# Altium schematic sheet Support.SchDoc
size A4
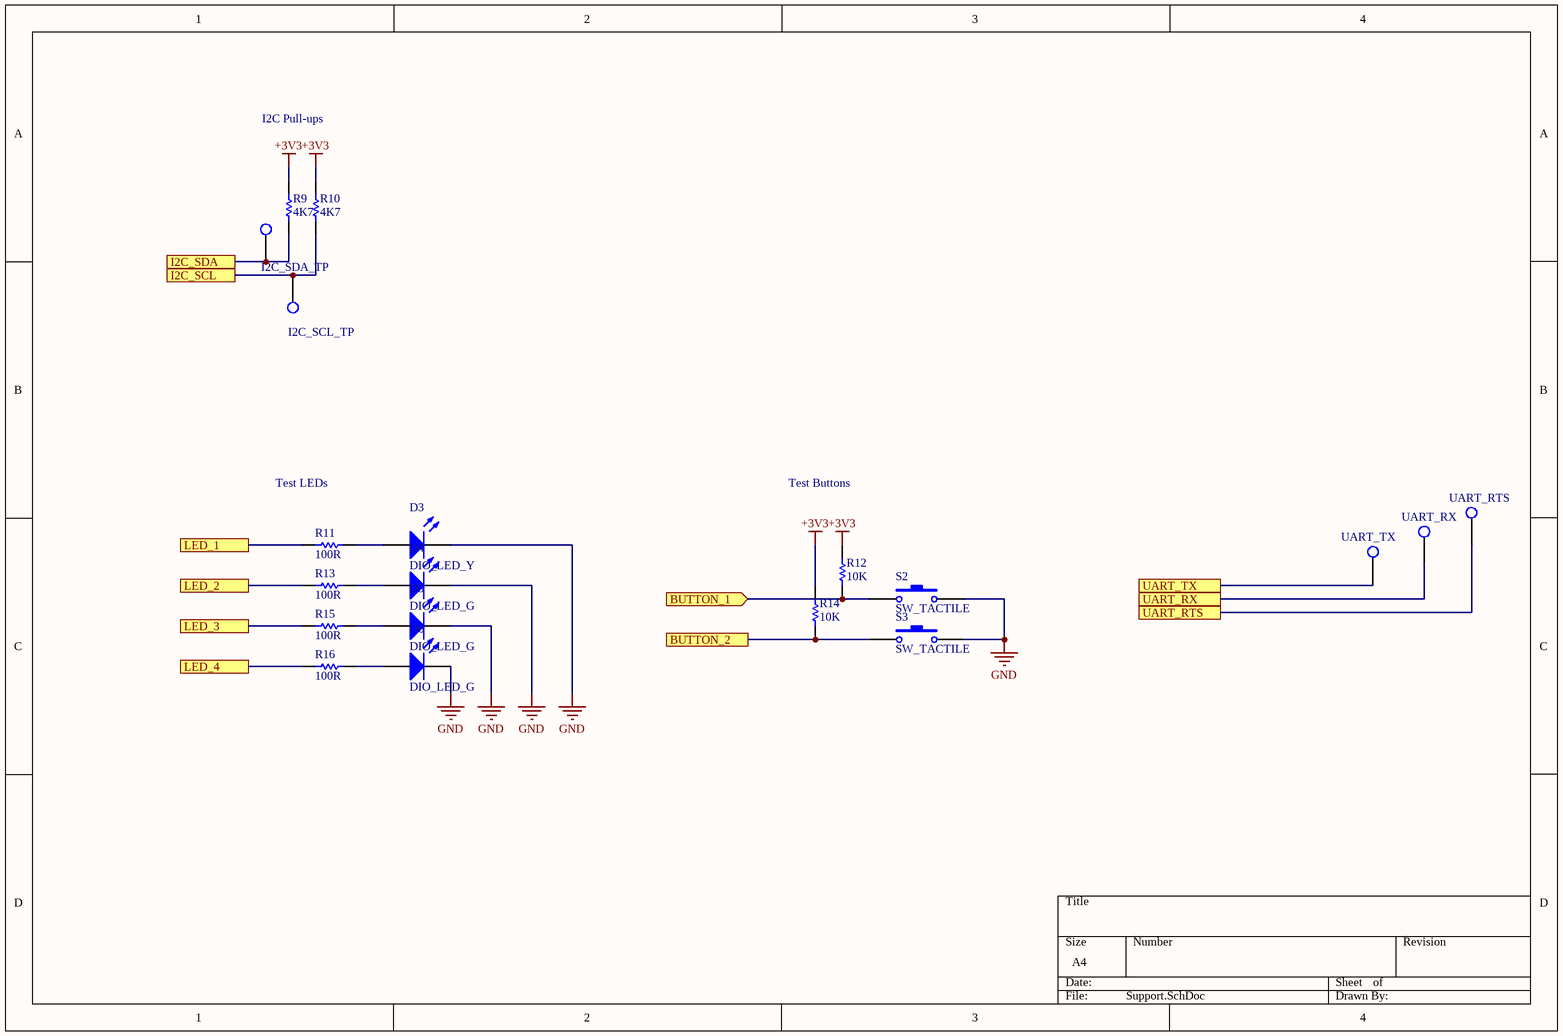
[diagram p0: Support.SchDoc]

## Parts
D3  DIO_LED_Y  [LED_0805]
D4  DIO_LED_G  [LED_0805]
D5  DIO_LED_G  [LED_0805]
D6  DIO_LED_G  [LED_0805]
R9  value 4K7  [RESC0603(1608)_N]  (hidden comment: RES_4K7_0603)
R10  value 4K7  [RESC0603(1608)_N]  (hidden comment: RES_4K7_0603)
R11  value 100R  [RESC0603(1608)_N]  (hidden comment: RES_100R_0603)
R12  value 10K  [RESC0603(1608)_N]  (hidden comment: RES_10K_0603)
R13  value 100R  [RESC0603(1608)_N]  (hidden comment: RES_100R_0603)
R14  value 10K  [RESC0603(1608)_N]  (hidden comment: RES_10K_0603)
R15  value 100R  [RESC0603(1608)_N]  (hidden comment: RES_100R_0603)
R16  value 100R  [RESC0603(1608)_N]  (hidden comment: RES_100R_0603)
S2  SW_TACTILE  [B3U-1100P]
S3  SW_TACTILE  [B3U-1100P]
TP7  I2C_SDA_TP  [TESTPOINT_LOOP]
TP8  I2C_SCL_TP  [TESTPOINT_LOOP]
TP9  UART_RTS  [TESTPOINT_LOOP]
TP10  UART_RX  [TESTPOINT_LOOP]
TP11  UART_TX  [TESTPOINT_LOOP]

## Ports
BUTTON_1 (in), BUTTON_2, I2C_SCL, I2C_SDA, LED_1, LED_2, LED_3, LED_4, UART_RTS, UART_RX, UART_TX

## Nets
+3V3: R9.2 R10.2 R12.2 R14.1
GND: D3.2(K) D4.2(K) D5.2(K) D6.2(K) S2.2 S3.2
BUTTON_1: R12.1 S2.1 ; port BUTTON_1
BUTTON_2: R14.2 S3.1 ; port BUTTON_2
I2C_SCL: R10.1 TP8.1(=value) ; port I2C_SCL
I2C_SDA: R9.1 TP7.1(=value) ; port I2C_SDA
LED_1: R11.1 ; port LED_1
LED_2: R13.1 ; port LED_2
LED_3: R15.1 ; port LED_3
LED_4: R16.1 ; port LED_4
UART_RTS: TP9.1(=value) ; port UART_RTS
UART_RX: TP10.1(=value) ; port UART_RX
UART_TX: TP11.1(=value) ; port UART_TX
NetD3_1: D3.1(A) R11.2
NetD4_1: D4.1(A) R13.2
NetD5_1: D5.1(A) R15.2
NetD6_1: D6.1(A) R16.2

## Notes on the sheet
- I2C Pull-ups
- Test LEDs
- Test Buttons

## Library data of the parts
D3 = DIO_LED_Y: LED YELLOW DIFFUSED 0805 SMD; Part Number: LY R976-PS-36; Manufacturer: OSRAM; Forward Voltage Drop: 2.2V; Package: 0805 (2012 Metric)
D4-D6 = DIO_LED_G: LED GREEN DIFFUSED 0805 SMD; Part Number: LG R971-KN-1; Manufacturer: OSRAM; Forward Voltage Drop: 2.2V; Package: 0805 (2012 Metric)
R9 R10 = RES_4K7_0603: RES SMD 4.7K OHM 5% 1/10W 0603; Manufacturer: Yageo; Part Number (MPN): RC0603JR-074K7L; Package: 0603 (1608 Metric); Dimensions: 0.063" L x 0.031" W (1.60mm x 0.80mm); Tolerance: 5%
R11 R13 R15 R16 = RES_100R_0603: RES SMD 100 OHM 1% 1/10W 0603; Manufacturer: Yageo; Part Number (MPN): RC0603FR-07100RL; Package: 0603 (1608 Metric); Dimensions: 0.063" L x 0.031" W (1.60mm x 0.80mm); Tolerance: 1%
R12 R14 = RES_10K_0603: RES SMD 10K OHM 5% 1/10W 0603; Manufacturer: Yageo; Part Number (MPN): RC0603JR-0710KL; Package: 0603 (1608 Metric); Dimensions: 0.063" L x 0.031" W (1.60mm x 0.80mm); Tolerance: 5%
S2 S3 = SW_TACTILE: Tactile Switch (Grey); Manufacturer Part Number: B3U-1100P; Digikey Part Number: SW1021TR-ND
TP7-TP11 = TESTPOINT_LOOP